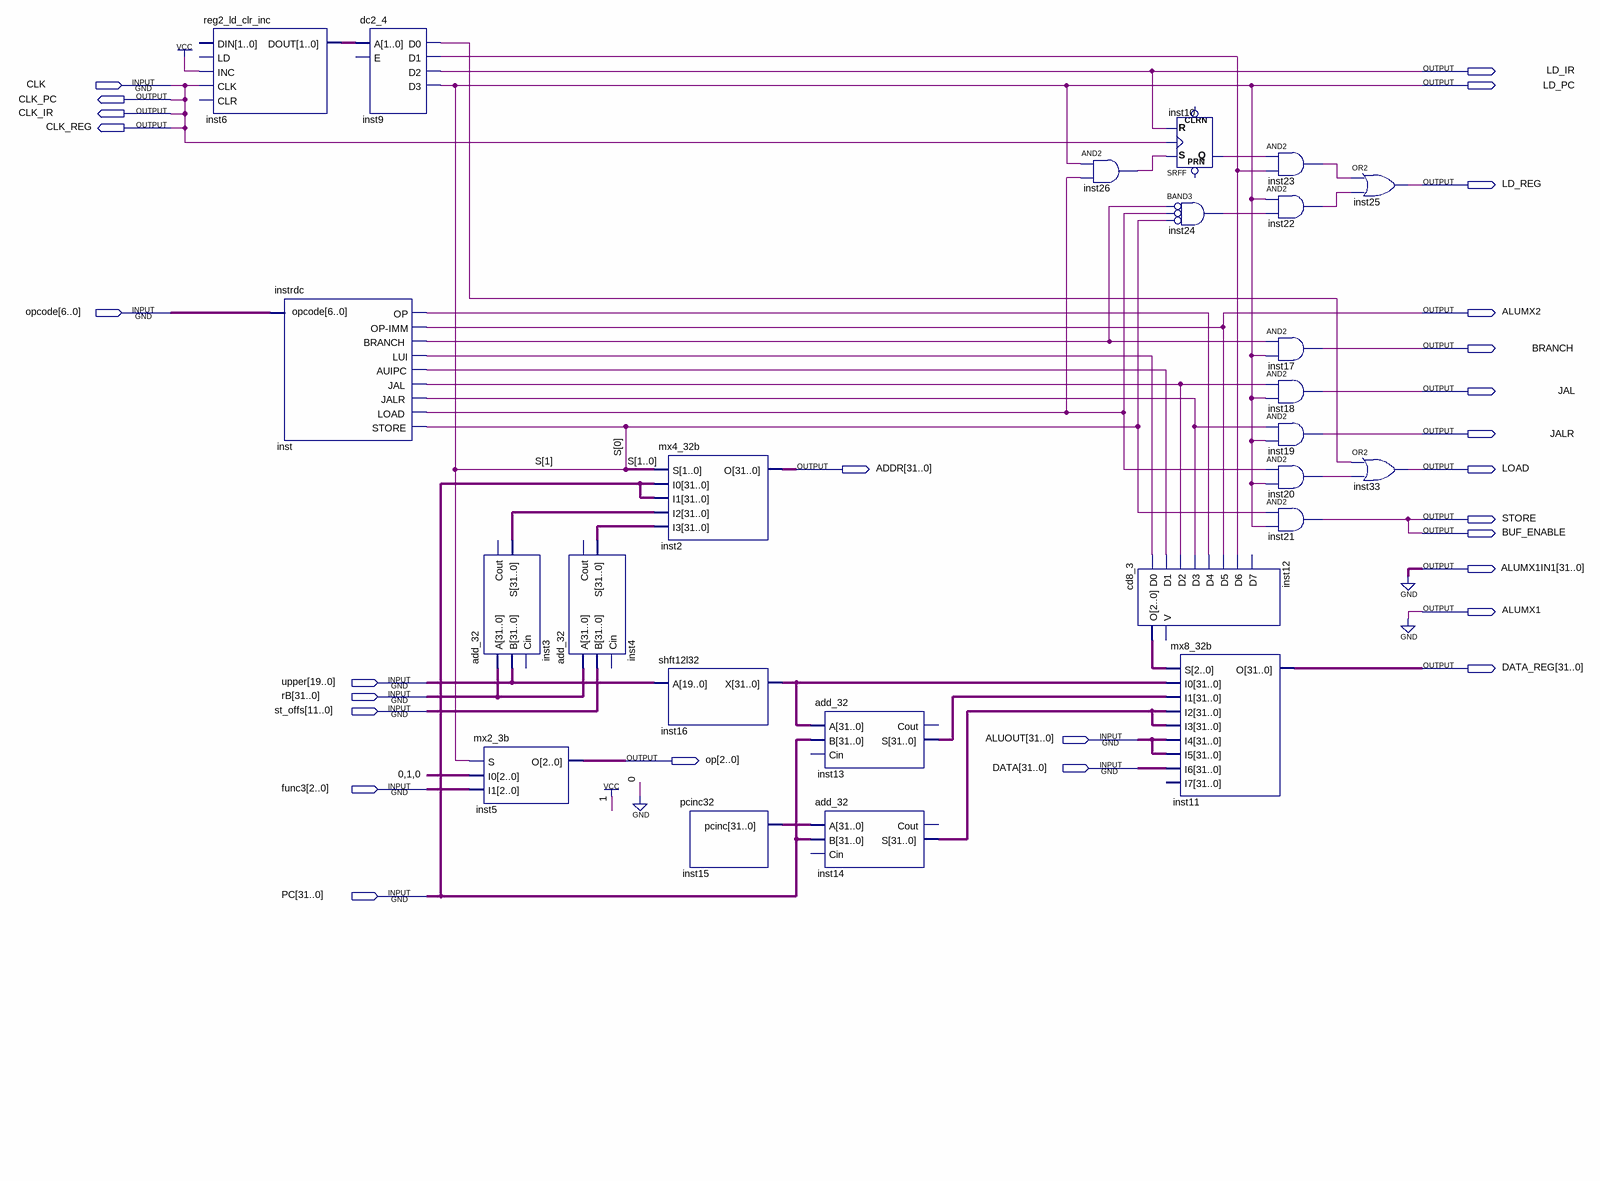
[diagram p0: schematic sheet]
// Quartus schematic tc.bdf as structural Verilog: 25 symbols, 27 pins
module tc (
  input  CLK,
  input  [6:0] opcode,
  input  [19:0] upper,
  input  [31:0] rB,
  input  [11:0] st_offs,
  input  [31:0] ALUOUT,
  input  [31:0] DATA,
  input  [2:0] func3,
  input  [31:0] PC,
  output LD_IR,
  output LD_PC,
  output CLK_PC,
  output CLK_IR,
  output CLK_REG,
  output LD_REG,
  output ALUMX2,
  output BRANCH,
  output JAL,
  output JALR,
  output [31:0] ADDR,
  output LOAD,
  output STORE,
  output BUF_ENABLE,
  output [31:0] ALUMX1IN1,
  output ALUMX1,
  output [31:0] DATA_REG,
  output [2:0] op
);

  wire inst9_d0, inst9_d1, inst10_q, inst20_out, inst22_out, inst23_out, inst24_out, inst26_out, inst_auipc,
       inst_branch, inst_jal, inst_jalr, inst_load, inst_lui, inst_op;
  wire [0:0] S;
  wire [1:0] inst6_dout;
  wire [2:0] inst12_o;
  wire [31:0] inst3_s, inst4_s, inst13_s, inst14_s, inst15_pcinc, inst16_x;

  reg2_ld_clr_inc inst6 (.INC(1'b1), .CLK(CLK), .DOUT(inst6_dout));  // open: DIN, LD, CLR
  instrdc inst (
    .opcode(opcode), .OP(inst_op), .\OP-IMM (ALUMX2), .BRANCH(inst_branch), .LUI(inst_lui),
    .AUIPC(inst_auipc), .JAL(inst_jal), .JALR(inst_jalr), .LOAD(inst_load), .STORE(S[0]));
  dc2_4 inst9 (.A(inst6_dout), .D0(inst9_d0), .D1(inst9_d1), .D2(LD_IR), .D3(LD_PC));  // open: E
  add_32 inst3 (.A(rB), .B({{21{upper[19]}}, upper[18:8]}), .S(inst3_s));  // open: Cin, Cout
  mx2_3b inst5 (.S(LD_PC), .I0(3'b010), .I1(func3), .O(op));
  add_32 inst4 (.A(rB), .B({{21{st_offs[11]}}, st_offs[10:0]}), .S(inst4_s));  // open: Cin, Cout
  mx4_32b inst2 (.S({LD_PC, S[0]}), .I0(PC), .I1(PC), .I2(inst3_s), .I3(inst4_s), .O(ADDR));
  shft12l32 inst16 (.A(upper), .X(inst16_x));
  pcinc32 inst15 (.pcinc(inst15_pcinc));
  add_32 inst13 (.A(inst16_x), .B(PC), .S(inst13_s));  // open: Cin, Cout
  add_32 inst14 (.A(inst15_pcinc), .B(PC), .S(inst14_s));  // open: Cin, Cout
  and inst26 (inst26_out, LD_PC, inst_load);
  cd8_3 inst12 (
    .D0(inst_lui), .D1(inst_auipc), .D2(inst_jal), .D3(inst_jalr), .D4(inst_op), .D5(ALUMX2), .D6(inst9_d1),
    .O(inst12_o));  // open: D7, V
  SRFF inst10 (.S(inst26_out), .R(LD_IR), .CLK(CLK), .Q(inst10_q));  // open: PRN, CLRN
  and inst24 (inst24_out, ~inst_branch, ~inst_load, ~S[0]);  // BAND3
  mx8_32b inst11 (
    .S(inst12_o), .I0(inst16_x), .I1(inst13_s), .I2(inst14_s), .I3(inst14_s), .I4(ALUOUT), .I5(ALUOUT),
    .I6(DATA), .O(DATA_REG));  // open: I7
  and inst23 (inst23_out, inst10_q, inst9_d1);
  and inst22 (inst22_out, LD_PC, inst24_out);
  and inst17 (BRANCH, inst_branch, LD_PC);
  and inst18 (JAL, inst_jal, LD_PC);
  and inst19 (JALR, inst_jalr, LD_PC);
  and inst20 (inst20_out, inst_load, LD_PC);
  and inst21 (BUF_ENABLE, S[0], LD_PC);
  or inst25 (LD_REG, inst23_out, inst22_out);
  or inst33 (LOAD, inst9_d0, inst20_out);

  assign ALUMX1 = 1'b0;
  assign ALUMX1IN1 = {32{1'b0}};
  assign CLK_IR = CLK;
  assign CLK_PC = CLK;
  assign CLK_REG = CLK;
  assign STORE = BUF_ENABLE;

  // Other names for the same wires on the sheet: o[11:0] = st_offs; S[1] = LD_PC; u[19:0] = upper
endmodule
